# Altium schematic sheet mos_board.SchDoc: P-MOS and RTD board
size A4; Author: Michał Gumiela; Model: EM1; PageSetup: Record=PageOptions|CenterHorizontal=True|CenterVertical=True|PrintScale=0.52|XCorrection=1.00|YCorrection=1.00|PrintKind=1|BorderSize=5000000|LeftOffset=0|BottomOffset=0|Orientation=2|PaperLength=4200|PaperWidth=2970|Scale=100|PaperSource=7|PrintQuality=600|MediaType=1|DitherType=10|PaperKind=A3|PrintScaleMode=1
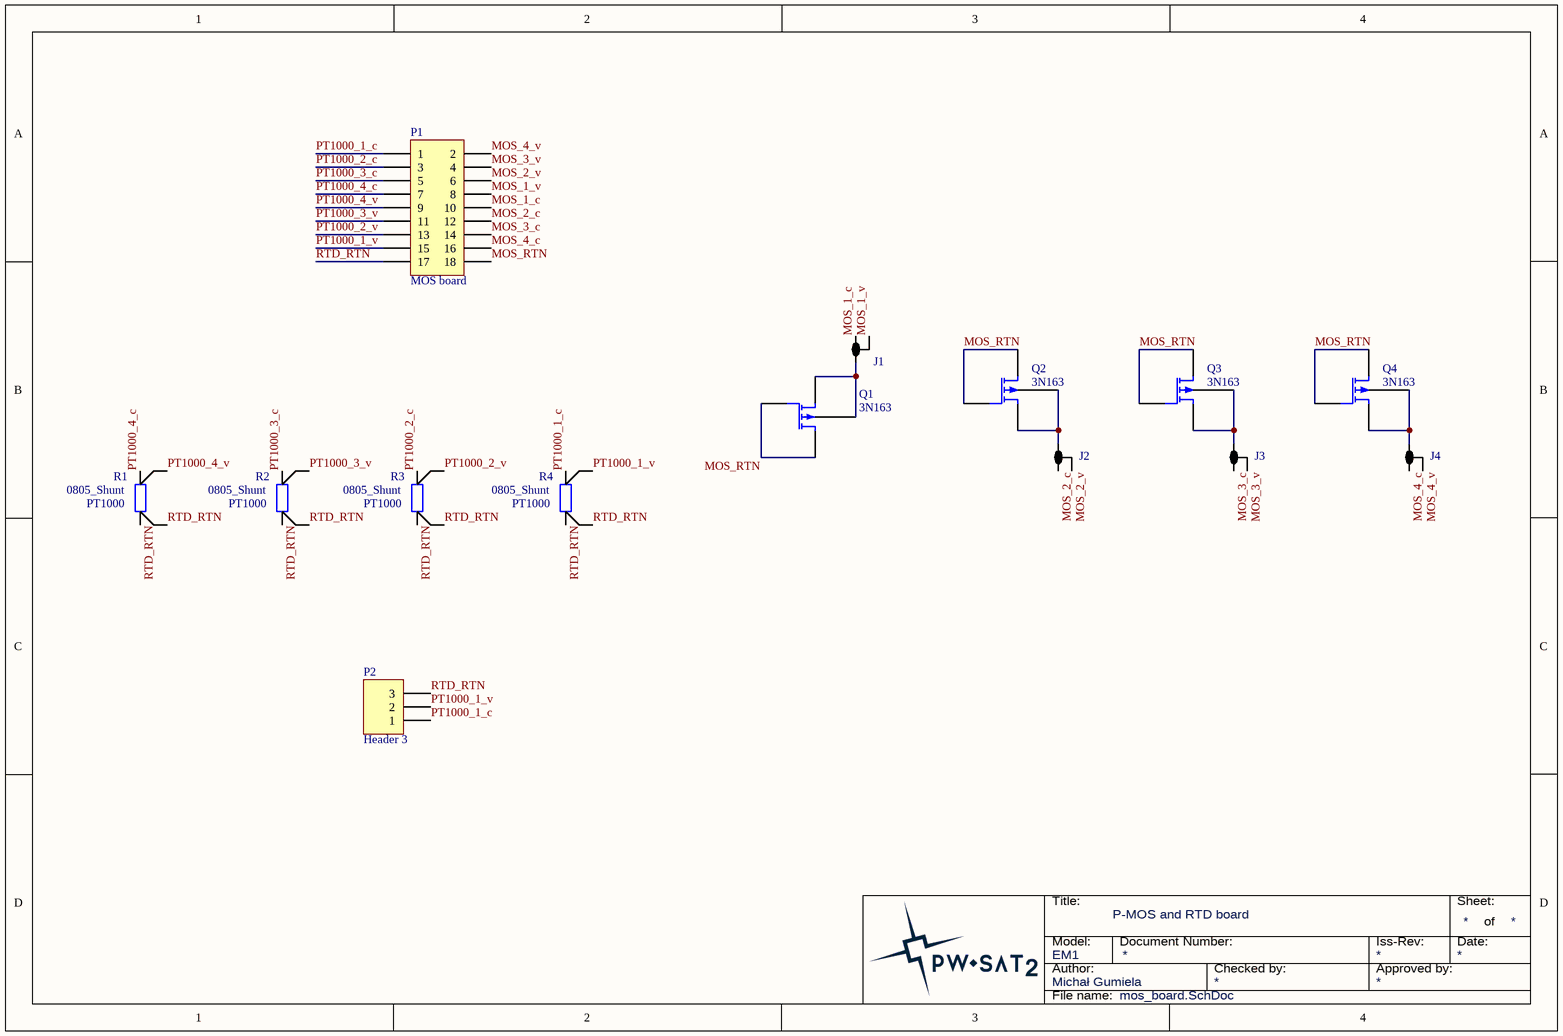
[diagram p0: mos_board.SchDoc]

## Parts
J1  3 way net tie junction Y shape  [3wayY_LP]  (value not drawn)  (net tie, no BOM)
J2  3 way net tie junction Y shape  [3wayY_LP]  (value not drawn)  (net tie, no BOM)
J3  3 way net tie junction Y shape  [3wayY_LP]  (value not drawn)  (net tie, no BOM)
J4  3 way net tie junction Y shape  [3wayY_LP]  (value not drawn)  (net tie, no BOM)
P1  MOS board  [HDR2X9]
P2  Header 3  [HDR1X3]
Q1  3N163  [TO-206AF]
Q2  3N163  [TO-206AF]
Q3  3N163  [TO-206AF]
Q4  3N163  [TO-206AF]
R1  Package: 0805_Shunt  [SMD_Resistor-shunt_0805]  (hidden comment: PT1000)
R2  Package: 0805_Shunt  [SMD_Resistor-shunt_0805]  (hidden comment: PT1000)
R3  Package: 0805_Shunt  [SMD_Resistor-shunt_0805]  (hidden comment: PT1000)
R4  Package: 0805_Shunt  [SMD_Resistor-shunt_0805]  (hidden comment: PT1000)

## Nets
MOS_1_c: J1.3 P1.10
MOS_1_v: J1.2 P1.8
MOS_2_c: J2.3 P1.12
MOS_2_v: J2.2 P1.6
MOS_3_c: J3.3 P1.14
MOS_3_v: J3.2 P1.4
MOS_4_c: J4.3 P1.16
MOS_4_v: J4.2 P1.2
MOS_RTN: P1.18 Q1.1(D) Q1.2(G) Q2.1(D) Q2.2(G) Q3.1(D) Q3.2(G) Q4.1(D) Q4.2(G)
PT1000_1_c: P1.1 P2.1 R4.1
PT1000_1_v: P1.15 P2.2 R4.2
PT1000_2_c: P1.3 R3.1
PT1000_2_v: P1.13 R3.2
PT1000_3_c: P1.5 R2.1
PT1000_3_v: P1.11 R2.2
PT1000_4_c: P1.7 R1.1
PT1000_4_v: P1.9 R1.2
RTD_RTN: P1.17 P2.3 R1.3 R1.4 R2.3 R2.4 R3.3 R3.4 R4.3 R4.4
NetJ1_1: J1.1 Q1.3(B) Q1.4(S)
NetJ2_1: J2.1 Q2.3(B) Q2.4(S)
NetJ3_1: J3.1 Q3.3(B) Q3.4(S)
NetJ4_1: J4.1 Q4.3(B) Q4.4(S)

## Notes on the sheet
- Title:
- Sheet:
- of
- Author:
- Model:
- Document Number:
- Checked by:
- Iss-Rev:
- Approved by:
- Date:
- File name:

## Library data of the parts
J1-J4 = 3wayY: ComponentLink1URL: http://www.edatools.cz/addons; ComponentLink1Description: Source; FootprintNote: LP=12mil, MP=40mil, HP=120mil
P1 = Header 9X2: Header, 9-Pin, Dual row; LatestRevisionDate: 17-Jul-2002; LatestRevisionNote: Re-released for DXP Platform.; Publisher: Altium Limited
P2 = Header 3: Header, 3-Pin; LatestRevisionDate: 17-Jul-2002; LatestRevisionNote: Re-released for DXP Platform.; Publisher: Altium Limited
Q1-Q4 = 3N163: P-MOS for military application
R1-R4 = PT1000: Platinum Thin-Film Chip Sensor; Manufacturer: IST INNOVATIVE SENSOR TECHNOLOGY; ManufacturerPartNumber: P1K0.0805.2P.A; TCR: 3850ppm/K; Farnell: http://pl.farnell.com/ist-innovative-sensor-technology/p1k0-0805-2p-a/sensor-pt1000-smd0805-class-a/dp/1266951; Manufacturer's Datasheet: http://www.farnell.com/datasheets/57422.pdf; Value: PT1000